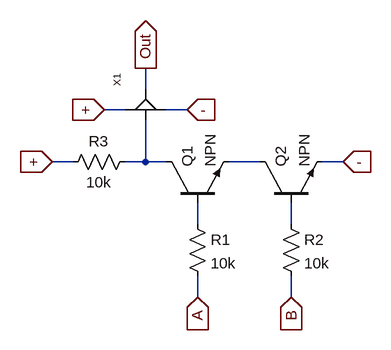
[diagram p0: schematic NAND.asc]
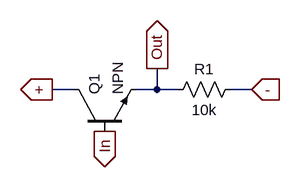
[diagram p1: sub-circuit buffer.asc]
NAND.asc, the LTspice schematic file:
Version 4
SHEET 1 880 680
WIRE 48 -96 48 -128
WIRE 16 -64 -16 -64
WIRE 112 -64 80 -64
WIRE -64 16 -96 16
WIRE 48 16 48 -48
WIRE 48 16 16 16
WIRE 80 16 48 16
WIRE 224 16 176 16
WIRE 352 16 320 16
WIRE 128 112 128 80
WIRE 272 112 272 80
WIRE 128 224 128 192
WIRE 272 224 272 192
FLAG 128 224 A
IOPIN 128 224 In
FLAG 272 224 B
IOPIN 272 224 In
FLAG 48 -128 Out
IOPIN 48 -128 Out
FLAG -96 16 +
IOPIN -96 16 In
FLAG 352 16 -
IOPIN 352 16 In
FLAG -16 -64 +
IOPIN -16 -64 In
FLAG 112 -64 -
IOPIN 112 -64 In
SYMBOL res 112 96 R0
SYMATTR InstName R1
SYMATTR Value 10k
SYMBOL res 256 96 R0
SYMATTR InstName R2
SYMATTR Value 10k
SYMBOL res 32 0 R90
WINDOW 0 0 56 VBottom 2
WINDOW 3 32 56 VTop 2
SYMATTR InstName R3
SYMATTR Value 10k
SYMBOL npn 80 80 R270
SYMATTR InstName Q1
SYMBOL npn 224 80 R270
SYMATTR InstName Q2
SYMBOL Buffer 48 -48 R270
SYMATTR InstName X1

buffer.asc, the sub-circuit schematic file:
Version 4
SHEET 1 880 680
WIRE 48 112 16 112
WIRE 176 112 176 80
WIRE 176 112 144 112
WIRE 208 112 176 112
WIRE 320 112 288 112
FLAG 176 80 Out
IOPIN 176 80 Out
FLAG 16 112 +
IOPIN 16 112 Out
FLAG 96 176 In
IOPIN 96 176 Out
FLAG 320 112 -
IOPIN 320 112 In
SYMBOL npn 48 176 R270
SYMATTR InstName Q1
SYMBOL res 304 96 R90
WINDOW 0 0 56 VBottom 2
WINDOW 3 32 56 VTop 2
SYMATTR InstName R1
SYMATTR Value 10k

The netlist it stands for:
* NAND.asc
R1 N003 A 10k
R2 N004 B 10k
R3 N001 + 10k
Q1 N001 N003 N002 0 NPN
Q2 N002 N004 - 0 NPN
XX1 N001 Out + - buffer

* block symbol definitions
.subckt buffer In Out + -
Q1 + In Out 0 NPN
R1 - Out 10k
.ends buffer

.model NPN NPN
.model PNP PNP
.lib standard.bjt
.backanno
.end